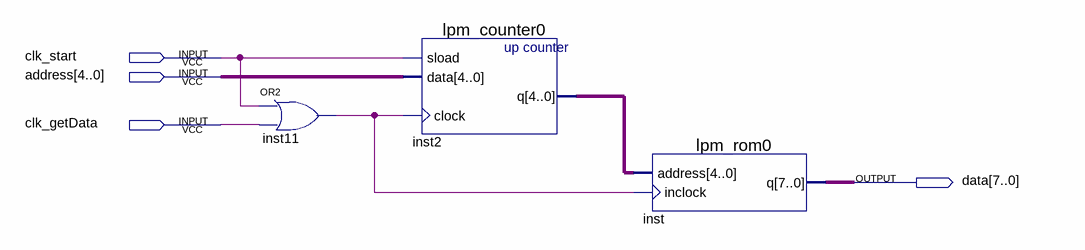
[diagram p0: schematic sheet]
// Quartus schematic ROM.bdf as structural Verilog: 3 symbols, 4 pins
module ROM (
  input  clk_start,
  input  [4:0] address,
  input  clk_getData,
  output [7:0] data
);

  wire inst11_out;
  wire [4:0] inst2_q;

  or inst11 (inst11_out, clk_start, clk_getData);
  lpm_counter0 inst2 (.sload(clk_start), .data(address), .clock(inst11_out), .q(inst2_q));
  lpm_rom0 inst (.address(inst2_q), .inclock(inst11_out), .q(data));
endmodule
